# Altium schematic sheet Main.SchDoc
size A4; Organization: Waterloop; Address1: 200 University Ave W; Address2: Engineering 5, 1104; Address3: Waterloo, ON; Address4: N2L 3G1; SheetNumber: 1; SheetTotal: 2
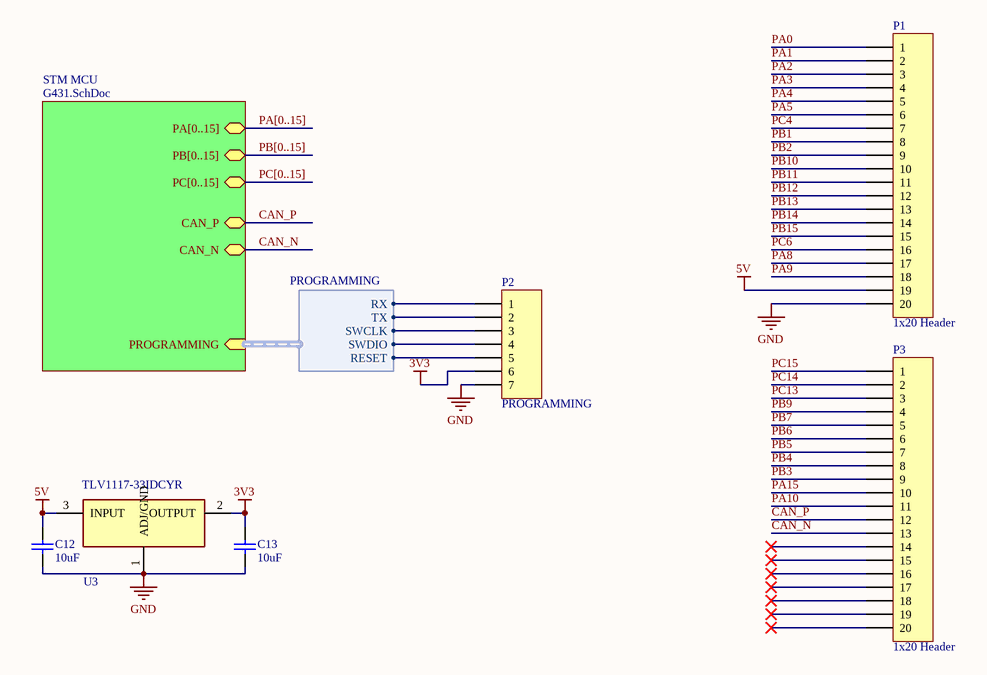
[diagram p0: Main.SchDoc]

## Parts
C12  value 10uF  [0805 - Capacitor]  (hidden comment: Capacitor - Nonpolarized)
C13  value 10uF  [0805 - Capacitor]  (hidden comment: Capacitor - Nonpolarized)
P1  1x20 Header  [HDR1X20]
P2  PROGRAMMING  [HDR1X7]
P3  1x20 Header  [HDR1X20]
U3  TLV1117-33IDCYR  [TLV1117]

## Sub-sheets
STM MCU = G431.SchDoc: PROGRAMMING (in, harness PROGRAMMING), PA[0..15] (bidir), PB[0..15] (bidir), PC[0..15] (bidir), CAN_P (bidir), CAN_N (bidir)

## Harnesses
PROGRAMMING: SWCLK, SWDIO, TX, RX, RESET

## Nets
3V3: C13.2 P2.6 U3.2(OUTPUT)
5V: C12.2 P1.19 U3.3(INPUT)
GND: C12.1 C13.1 P1.20 P2.7 U3.1(ADJ/GND)
CAN_N: P3.13 ; sheet STM MCU/CAN_N
CAN_P: P3.12 ; sheet STM MCU/CAN_P
PA0: P1.1
PA1: P1.2
PA2: P1.3
PA3: P1.4
PA4: P1.5
PA5: P1.6
PA8: P1.17
PA9: P1.18
PA10: P3.11
PA15: P3.10
PB1: P1.8
PB2: P1.9
PB3: P3.9
PB4: P3.8
PB5: P3.7
PB6: P3.6
PB7: P3.5
PB9: P3.4
PB10: P1.10
PB11: P1.11
PB12: P1.12
PB13: P1.13
PB14: P1.14
PB15: P1.15
PC4: P1.7
PC6: P1.16
PC13: P3.3
PC14: P3.2
PC15: P3.1
NetP2_1: P2.1 ; sheet STM MCU/PROGRAMMING.RX
NetP2_2: P2.2 ; sheet STM MCU/PROGRAMMING.TX
NetP2_3: P2.3 ; sheet STM MCU/PROGRAMMING.SWCLK
NetP2_4: P2.4 ; sheet STM MCU/PROGRAMMING.SWDIO
NetP2_5: P2.5 ; sheet STM MCU/PROGRAMMING.RESET

Not connected (* = marked no-connect by the designer): P3 14* 15* 16* 17* 18* 19* 20*

## Buses and harness runs
bus PA[0..15] = sheet STM MCU/PA[0..15]
bus PB[0..15] = sheet STM MCU/PB[0..15]
bus PC[0..15] = sheet STM MCU/PC[0..15]

## Notes on the sheet
- Title:
- Size:
- Date:
- A4
- Author:
- Revision:
- Sheet
- of
- File:

## Library data of the parts
C12 C13 = Capacitor - Nonpolarized: Nonpolarized Capacitor; Supplier Part Number: *; Supplier: *; Manufacturer: *; Rating: *; Manufacturer Part Number: *
P1 P3 = 1x20 Header: 1x20 Pin Header
P2 = 1x7 Header: 1x7 Pin Header
U3 = TLV1117-33IDCYR: Linear Voltage Regulator IC 3.3V 800MA SOT223-4; Manufacturer: Texas Instruments; Manufacturer Part Number: TLV1117-33IDCYR; Supplier Part Number: 296-21112-1-ND; Supplier: Digikey; ComponentLink1Description: Datasheet; ComponentLink1URL: http://www.ti.com/lit/ds/symlink/tlv1117.pdf?HQS=TI-null-null-digikeymode-df-pf-null-wwe&ts=1590668900314